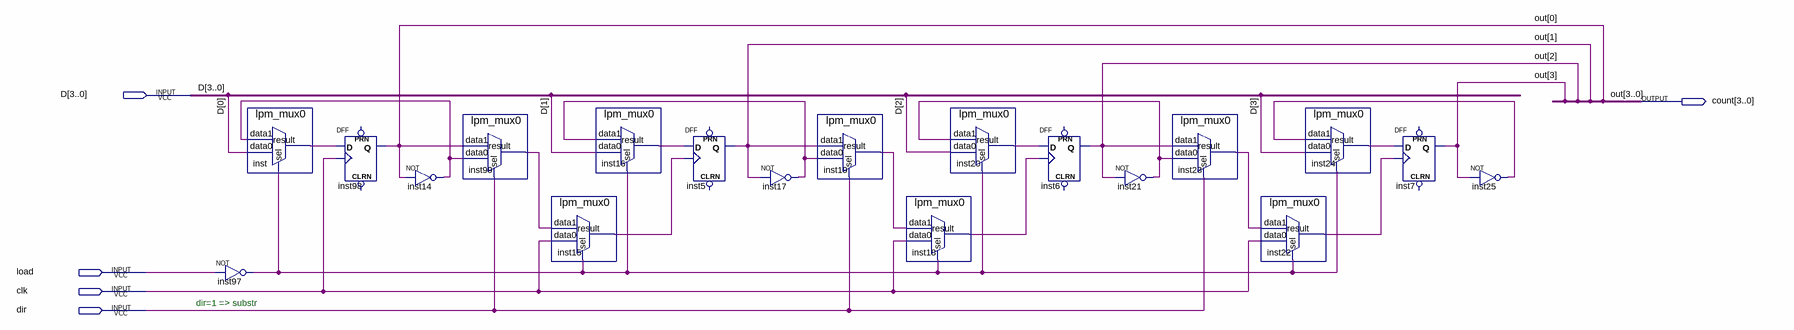
[diagram p0: schematic sheet]
// Quartus schematic counter15_old.bdf as structural Verilog: 19 symbols, 5 pins
module counter15_old (
  input  [3:0] D,
  input  load,
  input  clk,
  input  dir,
  output [3:0] count
);

  wire inst14_out, inst15_result, inst16_result, inst17_out, inst18_result, inst19_result, inst20_result,
       inst21_out, inst22_result, inst23_result, inst24_result, inst25_out, inst97_out, inst99_result,
       inst_result;

  lpm_mux0 inst (.data1(inst14_out), .data0(D[0]), .sel(inst97_out), .result(inst_result));
  not inst97 (inst97_out, load);
  DFF inst98 (.CLK(clk), .D(inst_result), .Q(count[0]));  // open: CLRN, PRN
  not inst14 (inst14_out, count[0]);
  lpm_mux0 inst99 (.data1(count[0]), .data0(inst14_out), .sel(dir), .result(inst99_result));
  lpm_mux0 inst15 (.data1(inst99_result), .data0(clk), .sel(inst97_out), .result(inst15_result));
  lpm_mux0 inst16 (.data1(inst17_out), .data0(D[1]), .sel(inst97_out), .result(inst16_result));
  DFF inst5 (.CLK(inst15_result), .D(inst16_result), .Q(count[1]));  // open: CLRN, PRN
  not inst17 (inst17_out, count[1]);
  lpm_mux0 inst19 (.data1(count[1]), .data0(inst17_out), .sel(dir), .result(inst19_result));
  lpm_mux0 inst18 (.data1(inst19_result), .data0(clk), .sel(inst97_out), .result(inst18_result));
  lpm_mux0 inst20 (.data1(inst21_out), .data0(D[2]), .sel(inst97_out), .result(inst20_result));
  DFF inst6 (.CLK(inst18_result), .D(inst20_result), .Q(count[2]));  // open: CLRN, PRN
  not inst21 (inst21_out, count[2]);
  lpm_mux0 inst23 (.data1(count[2]), .data0(inst21_out), .sel(dir), .result(inst23_result));
  lpm_mux0 inst22 (.data1(inst23_result), .data0(clk), .sel(inst97_out), .result(inst22_result));
  lpm_mux0 inst24 (.data1(inst25_out), .data0(D[3]), .sel(inst97_out), .result(inst24_result));
  DFF inst7 (.CLK(inst22_result), .D(inst24_result), .Q(count[3]));  // open: CLRN, PRN
  not inst25 (inst25_out, count[3]);

  // Other names for the same wires on the sheet: out[3:0] = count

  // Notes on the sheet:
  //   dir=1 => substr
endmodule
